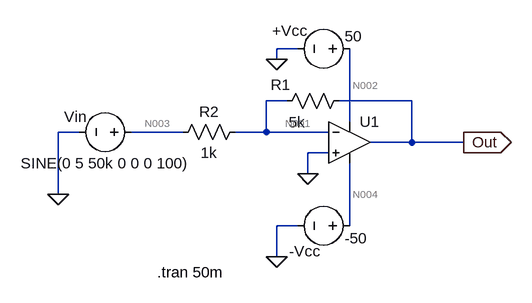
[diagram p0: schematic Inverter.asc]
Inverter.asc, the LTspice schematic file:
Version 4
SHEET 1 880 680
WIRE 96 48 64 48
WIRE 64 64 64 48
WIRE 80 128 48 128
WIRE 272 128 160 128
WIRE 176 160 176 48
WIRE -240 176 -272 176
WIRE -80 176 -160 176
WIRE 48 176 48 128
WIRE 48 176 0 176
WIRE 144 176 48 176
WIRE 272 192 272 128
WIRE 272 192 208 192
WIRE 352 192 272 192
WIRE 144 208 112 208
WIRE 112 240 112 208
WIRE -272 272 -272 176
WIRE 96 320 64 320
WIRE 176 320 176 224
WIRE 64 368 64 320
FLAG 352 192 Out
IOPIN 352 192 Out
FLAG -272 272 0
FLAG 64 368 0
FLAG 64 64 0
FLAG 112 240 0
SYMBOL Opamps\\UniversalOpamp2 176 192 R0
SYMATTR InstName U1
SYMBOL voltage 192 48 R90
WINDOW 0 -12 108 VBottom 2
WINDOW 3 -35 10 VTop 2
WINDOW 123 0 0 Left 2
WINDOW 39 0 0 Left 2
SYMATTR InstName +Vcc
SYMATTR Value 50
SYMBOL voltage 192 320 R90
WINDOW 0 55 85 VBottom 2
WINDOW 3 4 6 VTop 2
WINDOW 123 0 0 Left 2
WINDOW 39 0 0 Left 2
SYMATTR InstName -Vcc
SYMATTR Value -50
SYMBOL res 64 144 R270
WINDOW 0 25 6 VTop 2
WINDOW 3 -1 31 VBottom 2
SYMATTR InstName R1
SYMATTR Value 5k
SYMBOL res 16 160 R90
WINDOW 0 0 56 VBottom 2
WINDOW 3 32 56 VTop 2
SYMATTR InstName R2
SYMATTR Value 1k
SYMBOL voltage -144 176 R90
WINDOW 0 -8 102 VBottom 2
WINDOW 3 32 56 VTop 2
WINDOW 123 0 0 Left 2
WINDOW 39 0 0 Left 2
SYMATTR InstName Vin
SYMATTR Value SINE(0 5 50k 0 0 0 100)
TEXT -120 392 Left 2 !.tran 50m

The netlist it stands for:
* Inverter.asc
XU1 0 N001 N002 N004 Out level.2 Avol=1Meg GBW=10Meg Slew=10Meg ilimit=25m rail=0 Vos=0 phimargin=45 en=0 enk=0 in=0 ink=0 Rin=500Meg  ; pins IN+ IN- V+ V- OUT
V§+Vcc N002 0 50
V§-Vcc N004 0 -50
R1 N001 Out 5k
R2 N001 N003 1k
Vin N003 0 SINE(0 5 50k 0 0 0 100)
.tran 50m
.lib UniversalOpamps2.sub
.backanno
.end

* Results of the author's LTspice run, read from the files saved beside the schematic
* Operating Point, zero values left out:
*   V(n002) = 50 V
*   V(n004) = -50 V
*   I(-vcc) = 4.935 mA
*   I(+vcc) = -4.935 mA
*   Ix(u1:3) = 4.935 mA
*   Ix(u1:4) = -4.935 mA
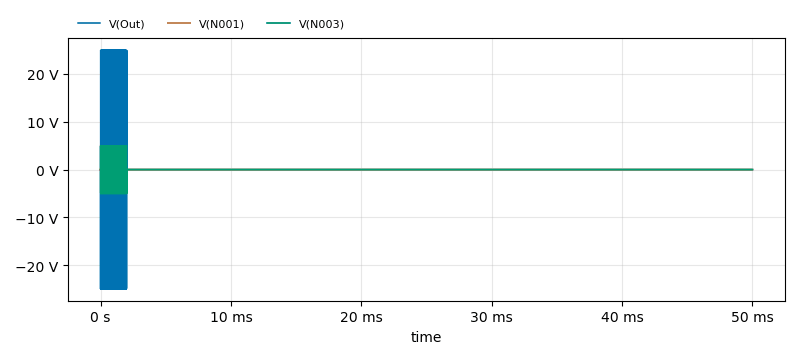
[diagram p1: Transient Analysis of Inverter.asc, plotted from the saved traces]
* Transient Analysis, 1 run:
*   V(Out): min -24.92 V, max 24.91 V, average 5.413 µV, rms 3.52 V, last 0 V
*   V(N001): min -153.7 mV, max 167.1 mV, average 1.162 µV, rms 20.63 mV, last 0 V
*   V(N003): min -4.988 V, max 4.988 V, average 0 V, rms 704.8 mV, last 0 V